# Altium project wchlink.PrjPCB
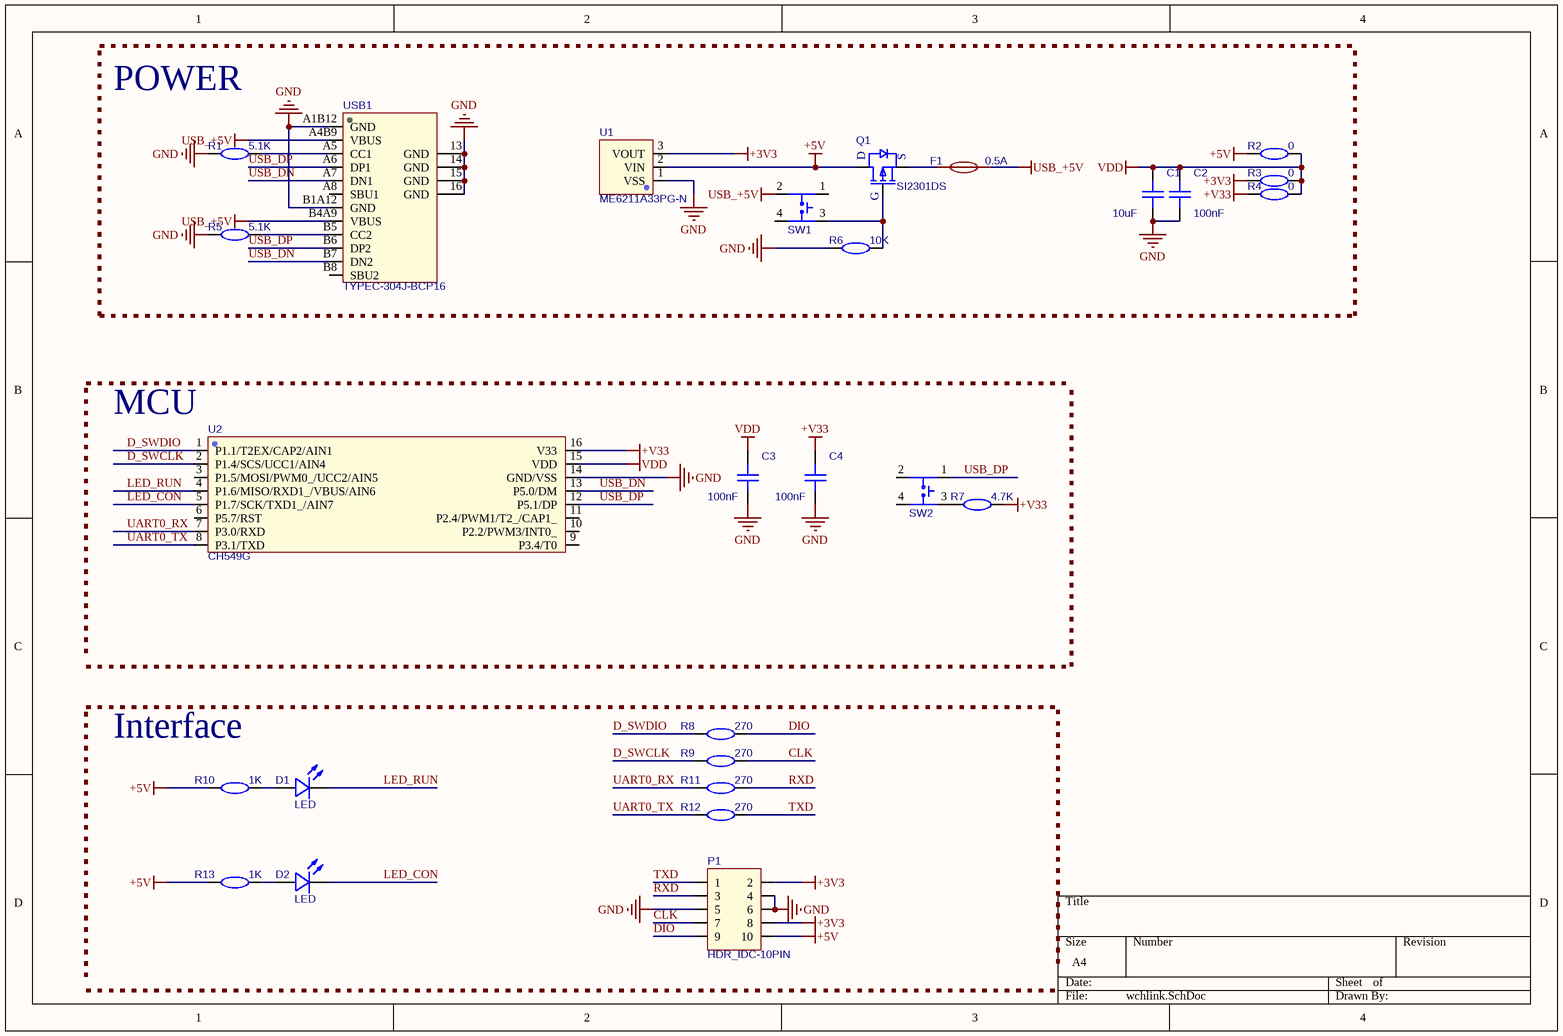
[diagram p0: wchlink.SchDoc]
1 sheet, 27 parts. Net scope: global (net labels, ports and power ports of the same name join across sheets).
Board file: wchlink.PcbDoc

## Sheet wchlink.SchDoc
size A4

### Parts
C1  10uF  [C0603]
C2  100nF  [C0603]
C3  100nF  [C0603]
C4  100nF  [C0603]
D1  LED  [LED-0603]
D2  LED  [LED-0603]
F1  0.5A  [R0805]
P1  HDR_IDC-10PIN  [IDC-2X5PIN]
Q1  SI2301DS  [SOT-23-3_L2.9-W1.3-P1.90-LS2.4-BR]
R1  5.1K  [R0603]
R2  0  [R0603]
R3  0  [R0603]
R4  0  [R0603]
R5  5.1K  [R0603]
R6  10K  [R0603]
R7  4.7K  [R0603]
R8  270  [R0603]
R9  270  [R0603]
R10  1K  [R0603]
R11  270  [R0603]
R12  270  [R0603]
R13  1K  [R0603]
SW1  TS-1071SA-A3B3-D4  [KEY-SMD_4P-L3.5-W3.0-P1.40-LS4.6]  (value not drawn)
SW2  TS-1071SA-A3B3-D4  [KEY-SMD_4P-L3.5-W3.0-P1.40-LS4.6]  (value not drawn)
U1  ME6211A33PG-N  [SOT-89_L4.5-W2.5-P1.50-LS4.2-BR]
U2  CH549G  [SOP-16_L10.0-W3.9-P1.27-LS6.0-BL]
USB1  TYPEC-304J-BCP16  [USB-C-SMD_TYPEC-304J-BCP16]

### Blocks framed on the sheet
POWER: C1 C2 F1 Q1 R1-R6 SW1 U1 USB1

### Nets
+3V3: P1.2 P1.8 R3.2 U1.3(VOUT)
+5V: P1.10 Q1.3(D) R2.2 R10.2 R13.2 U1.2(VIN)
+V33: C4.2 R4.2 R7.1 U2.16(V33)
GND: C1.1 C2.1 C3.1 C4.1 P1.4 P1.5 P1.6 R1.2 R5.2 R6.2 U1.1(VSS) U2.14(GND/VSS) USB1.13(GND) USB1.14(GND) USB1.15(GND) USB1.16(GND) USB1.A1B12(GND) USB1.B1A12(GND)
USB_+5V: F1.2 SW1.2 USB1.A4B9(VBUS) USB1.B4A9(VBUS)
VDD: C1.2 C2.2 C3.2 R2.1 R3.1 R4.1 U2.15(VDD)
CLK: P1.7 R9.1
D_SWCLK: R9.2 U2.2(P1.4/SCS/UCC1/AIN4)
D_SWDIO: R8.2 U2.1(P1.1/T2EX/CAP2/AIN1)
DIO: P1.9 R8.1
LED_CON: D2.2(K) U2.5(P1.7/SCK/TXD1_/AIN7)
LED_RUN: D1.2(K) U2.4(P1.6/MISO/RXD1_/VBUS/AIN6)
RXD: P1.3 R11.1
TXD: P1.1 R12.1
UART0_RX: R11.2 U2.7(P3.0/RXD)
UART0_TX: R12.2 U2.8(P3.1/TXD)
USB_DN: U2.13(P5.0/DM) USB1.A7(DN1) USB1.B7(DN2)
USB_DP: SW2.1 U2.12(P5.1/DP) USB1.A6(DP1) USB1.B6(DP2)
NetD1_1: D1.1(A) R10.1
NetD2_1: D2.1(A) R13.1
NetF1_1: F1.1 Q1.2(S)
NetQ1_1: Q1.1(G) R6.1 SW1.3
NetR1_1: R1.1 USB1.A5(CC1)
NetR5_1: R5.1 USB1.B5(CC2)
NetR7_2: R7.2 SW2.3

Not connected (* = marked no-connect by the designer): SW1 1 4; SW2 2 4; U2 3(P1.5/MOSI/PWM0_/UCC2/AIN5) 6(P5.7/RST) 9(P3.4/T0) 10(P2.2/PWM3/INT0_) 11(P2.4/PWM1/T2_/CAP1_); USB1 A8(SBU1) B8(SBU2)

### Notes on the sheet
- (near U2) MCU
- Interface

### Library data of the parts
C1-C4 = CAP_0603: BOM_Manufacturer: YAGEO; BOM_Manufacturer Part: CC0603GRNPO9BN200; nameAlias: Capacitance; Contributor: LCSC; BOM_Supplier: LCSC; BOM_Supplier Part: C325469; spicePre: C; spiceSymbolName: CC0603GRNPO9BN200
D1 D2 = LED-Y: nameAlias: Model; BOM_Manufacturer Part: ?; spicePre: D; spiceSymbolName: LED
F1 = 0.5A: BOM_Manufacturer: Brightking Elec (TAIWAN); BOM_Manufacturer Part: SMD0805B050TF; Contributor: LCSC; BOM_Supplier: LCSC; BOM_Supplier Part: C269104; spicePre: U; spiceSymbolName: SMD0805B050TF
P1 = HDR_IDC-10PIN: BOM_Manufacturer: BOOMELE; BOM_Manufacturer Part: IDC Box 2.54mm 2X5P; BOM_Paste Type: expand; Package Display: No; BOM_Supplier: LCSC; image: //image.lceda.cn/szlcsc/C5665.jpg; BOM_Supplier Part: C5665; spicePre: P; spiceSymbolName: HDR-IDC-2.54-2X5P
Q1 = SI2301DS: BOM_Manufacturer: TECH PUBLIC(台舟); Contributor: LCSC; BOM_Supplier: LCSC; BOM_Supplier Part: C2841444; BOM_Manufacturer Part: SI2301DS; spicePre: Q; spiceSymbolName: SI2301DS
R1-R13 = RES_0603: BOM_Manufacturer: LIZ; BOM_Manufacturer Part: CR0603JA0301G; nameAlias: Resistance (Ohms); BOM_Supplier: LCSC; BOM_Supplier Part: C101323; spicePre: R; spiceSymbolName: CR0603JA0301G
SW1 SW2 = TS-1071SA-A3B3-D4: BOM_Manufacturer: Yuandi; Contributor: LCSC; BOM_Supplier: LCSC; BOM_Supplier Part: C498309; BOM_Manufacturer Part: TS-1071SA-A3B3-D4; BOM_JLCPCB Part Class: Extended Part; spicePre: S; spiceSymbolName: TS-1071SA-A3B3-D4
U1 = ME6211A33PG-N: BOM_Manufacturer: Nanjing Micro One Elec; Contributor: LCSC; BOM_Supplier: LCSC; BOM_Supplier Part: C236673; BOM_Manufacturer Part: ME6211A33PG-N; BOM_JLCPCB Part Class: Extended Part; spicePre: U; spiceSymbolName: ME6211A33PG-N
U2 = CH549G: BOM_Manufacturer: WCH; Contributor: Fangbrbr; BOM_Supplier: LCSC; BOM_Manufacturer Part: CH549G; BOM_Supplier Part: C108958; spicePre: U; spiceSymbolName: CH549G
USB1 = TYPEC-304J-BCP16: BOM_Manufacturer: XUNPU(讯普); Contributor: LCSC; BOM_Supplier: LCSC; BOM_Supplier Part: C2835315; BOM_Manufacturer Part: TYPEC-304J-BCP16; BOM_JLCPCB Part Class: Extended Part; spicePre: U; spiceSymbolName: TYPEC-304J-BCP16